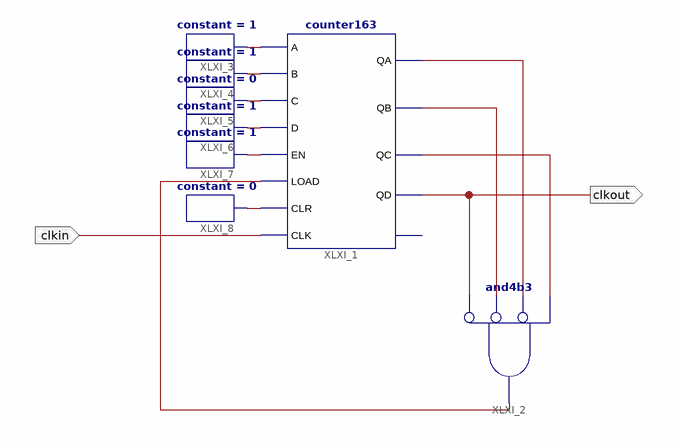
[diagram p0: schematic sheet 1]
// Xilinx ISE schematic clk1.sch (spartan3e) as structural Verilog: 8 symbols, 2 ports
module clk1 (
  input  clkin,
  output clkout
);

  wire XLXN_1, XLXN_2, XLXN_3, XLXN_6, XLXN_7, XLXN_8, XLXN_9, XLXN_10, XLXN_11, XLXN_12;

  counter163 XLXI_1 (
    .A(XLXN_7), .B(XLXN_8), .C(XLXN_9), .D(XLXN_10), .EN(XLXN_11), .LOAD(XLXN_6), .CLR(XLXN_12), .CLK(clkin),
    .QA(XLXN_2), .QD(clkout), .QB(XLXN_3), .QC(XLXN_1));  // open: RCO
  and XLXI_2 (XLXN_6, ~clkout, ~XLXN_3, ~XLXN_2, XLXN_1);  // and4b3
  constant #(.CValue("1")) XLXI_3 (.O(XLXN_7));
  constant #(.CValue("1")) XLXI_4 (.O(XLXN_8));
  constant #(.CValue("0")) XLXI_5 (.O(XLXN_9));
  constant #(.CValue("1")) XLXI_6 (.O(XLXN_10));
  constant #(.CValue("1")) XLXI_7 (.O(XLXN_11));
  constant #(.CValue("0")) XLXI_8 (.O(XLXN_12));
endmodule
